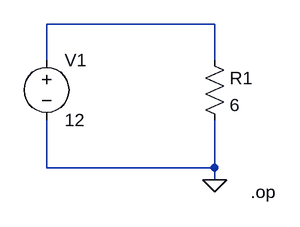
[diagram p0: schematic simple_resistor_ckt.asc]
simple_resistor_ckt.asc, the LTspice schematic file:
Version 4
SHEET 1 880 680
WIRE 320 64 96 64
WIRE 96 112 96 64
WIRE 320 112 320 64
WIRE 96 256 96 192
WIRE 320 256 320 192
WIRE 320 256 96 256
WIRE 320 272 320 256
FLAG 320 272 0
SYMBOL voltage 96 96 R0
SYMATTR InstName V1
SYMATTR Value 12
SYMBOL res 304 96 R0
SYMATTR InstName R1
SYMATTR Value 6
TEXT 368 288 Left 2 !.op

The netlist it stands for:
* simple_resistor_ckt.asc
V1 N001 0 12
R1 N001 0 6
.op
.backanno
.end